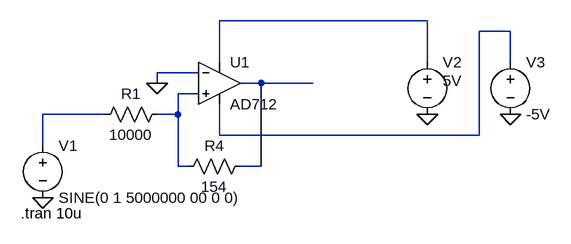
[diagram p0: schematic schimdt triger.asc]
schimdt triger.asc, the LTspice schematic file:
Version 4
SHEET 1 880 680
WIRE 656 64 336 64
WIRE 784 80 736 80
WIRE 336 128 336 64
WIRE 656 128 656 64
WIRE 784 128 784 80
WIRE 304 144 240 144
WIRE 240 160 240 144
WIRE 400 160 368 160
WIRE 480 160 400 160
WIRE 304 176 272 176
WIRE 160 208 64 208
WIRE 272 208 272 176
WIRE 272 208 240 208
WIRE 336 240 336 192
WIRE 736 240 736 80
WIRE 736 240 336 240
WIRE 64 256 64 208
WIRE 272 288 272 208
WIRE 288 288 272 288
WIRE 400 288 400 160
WIRE 400 288 368 288
FLAG 240 160 0
FLAG 64 336 0
FLAG 656 208 0
FLAG 784 208 0
SYMBOL res 256 192 R90
WINDOW 0 0 56 VBottom 2
WINDOW 3 32 56 VTop 2
SYMATTR InstName R1
SYMATTR Value 10000
SYMBOL res 384 272 R90
WINDOW 0 0 56 VBottom 2
WINDOW 3 32 56 VTop 2
SYMATTR InstName R4
SYMATTR Value 154
SYMBOL voltage 64 240 R0
WINDOW 123 0 0 Left 0
WINDOW 39 0 0 Left 0
SYMATTR InstName V1
SYMATTR Value SINE(0 1 5000000 00 0 0)
SYMBOL OpAmps\\AD712 336 96 R0
SYMATTR InstName U1
SYMBOL voltage 656 112 R0
WINDOW 3 24 44 Left 2
WINDOW 123 0 0 Left 0
WINDOW 39 0 0 Left 0
SYMATTR InstName V2
SYMATTR Value 5V
SYMBOL voltage 784 112 R0
WINDOW 123 0 0 Left 0
WINDOW 39 0 0 Left 0
SYMATTR InstName V3
SYMATTR Value -5V
TEXT 30 360 Left 2 !.tran 10u

The netlist it stands for:
* schimdt triger.asc
R1 N004 N005 10000
R4 N003 N004 154
V1 N005 0 SINE(0 1 5000000 00 0 0)
XU1 N004 0 N001 N002 N003 AD712  ; pins In+ In- V+ V- OUT
V2 N001 0 5V
V3 N002 0 -5V
.tran 10u
.backanno
.end